# EAGLE schematic Eagle (EAGLE 9.3.0)
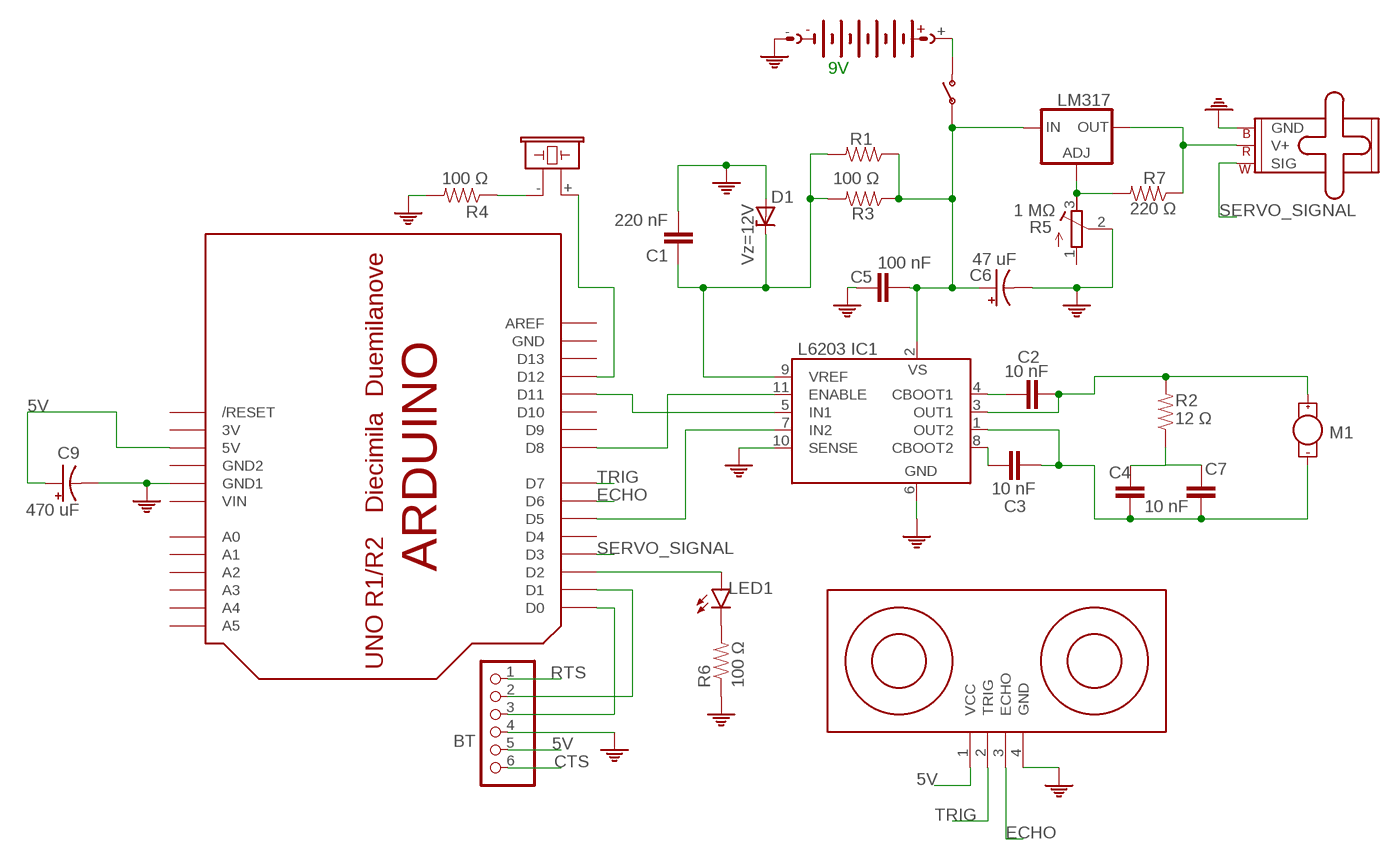
[diagram p0: schematic, sheet 1]

## Parts
9V  9V  AB9V  [AB9V]
BT  PINHD-1X6  [1X06]
C1  220 nF  CAPEZ  [CAP-PTH-SMALLEZ]
C2  10 nF  CAPEZ  [CAP-PTH-SMALLEZ]
C3  10 nF  CAPEZ  [CAP-PTH-SMALLEZ]
C4  10 nF  CAPEZ  [CAP-PTH-SMALLEZ]
C5  100 nF  CAPEZ  [CAP-PTH-SMALLEZ]
C6  47 uF  CPOL-USE5-4  [E5-4]
C7  10 nF  CAPEZ  [CAP-PTH-SMALLEZ]
C9  470 uF  CPOL-USB45181A  [B45181A]
D1  Vz=12V  ZENER-DIODEC1702-15  [C1702-15]
IC1  L6203  [MULTIWATT-11]
LED1  LED1  LED-3MM-NO_SILK  [LED3MM-NS]
LM317  LM317TS  [317TS]
M1  MOTOR10MM  [VIBE-MOTOR-10MM]
M2  SMALL_SERVO  [1X03]
R1  100 Ω  RESISTOREZ  [AXIAL-0.3EZ]
R2  12 Ω  RESISTOREZ  [AXIAL-0.3EZ]
R3  100 Ω  RESISTOREZ  [AXIAL-0.3EZ]
R4  100 Ω  RESISTOREZ  [AXIAL-0.3EZ]
R5  1 MΩ  R-TRIMM3296W  [RTRIM3296W]
R6  100 Ω  RESISTOREZ  [AXIAL-0.3EZ]
R7  220 Ω  RESISTOREZ  [AXIAL-0.3EZ]
SG1  F/CM04P  [F/CM04P]
U$1  ARDUINOUNO  [ARDUINO]
U$2  ULTRASONIC-HC-SR04#V  [ULTRASONIC-HC-SR04#V]
U$3  SWITCH-SPST-2TV  [SWITCH-SPST-VERTICAL]

## Nets
5V: BT.5 C9.+ U$1.5V U$2.1(VCC)
CTS: BT.6
ECHO: U$1.D6 U$2.3(ECHO)
N$1: C4.1 C7.1 R2.P$1
N$2: IC1.7(IN2) U$1.D5
N$3: IC1.5(IN1) U$1.D11
N$4: C3.1 C4.2 C7.2 IC1.1(OUT2) M1.-
N$5: C2.2 IC1.3(OUT1) M1.+ R2.P$2
N$6: IC1.11(ENABLE) U$1.D8
N$7: C2.1 IC1.4(CBOOT1)
N$8: C3.2 IC1.8(CBOOT2)
N$9: C5.2 C6.+ IC1.2(VS) LM317.3(IN) R1.P$1 R3.P$1 U$3.2(P)
N$10: 9V.+ U$3.1(O)
N$11: LED1.A U$1.D2
N$12: SG1.+ U$1.D12
N$13: R4.P$1 SG1.-
N$14: LED1.K(C) R6.P$2
N$15: LM317.1(ADJ) R5.3(E) R7.P$2
N$16: LM317.2(OUT) M2.2(V+) R7.P$1
N$17: M2.1(SIG)
N$18: BT.3 U$1.D0
N$19: BT.2 U$1.D1
PE: 9V.- BT.4 C1.2 C5.1 C6.- C9.- D1.A IC1.6(GND) IC1.10(SENSE) M2.3(GND) R4.P$2 R5.2(S) R6.P$1 U$1.GND1 U$2.4(GND)
RTS: BT.1
SERVO_SIGNAL: U$1.D3
TRIG: U$1.D7 U$2.2(TRIG)
VREF: C1.1 D1.C IC1.9(VREF) R1.P$2 R3.P$2
Unconnected: R5.1(A) U$1.A0 U$1.A1 U$1.A2 U$1.A3 U$1.A4 U$1.A5 U$1.AREF U$1.D4 U$1.D9 U$1.D10 U$1.D13 U$1.RESET(/RESET)

## Notes on the sheet
- 9V

## Power pins joined to a net without a drawn wire
3V: U$1.3V
GND: U$1.GND
GND2: U$1.GND2
VIN: U$1.VIN

## Library data of the parts
9V = battery:AB9V: 9-V BATTERY CLIP
BT = adafruit:PINHD-1X6: PIN HEADER
C1-C5 C7 = SparkFun-Capacitors:CAP: Capacitor Standard 0603 ceramic capacitor, and 0.1" leaded capacitor.
C6 = rcl:CPOL-US: POLARIZED CAPACITOR, American symbol
C9 = resistor:CPOL-US: POLARIZED CAPACITOR, American symbol
D1 = diode:ZENER-DIODE: Z-Diode
IC1 = st-microelectronics:L6203: DMOS FULL BRIDGE DRIVER; MPN: L6203; OC_FARNELL: 1467715; OC_NEWARK: 56P8434
LED1 = SparkFun-LED:LED: LEDs Standard schematic elements and footprints for 5mm, 3mm, 1206, and 0603 sized LEDs. 5mm - Spark Fun Electronics SKU : COM-00529 (and others)
LM317 = v-reg:LM317TS: VOLTAGE REGULATOR
M1 = SparkFun-Electromechanical:MOTOR: Vibration Motor- ROB-08449 Physical dimension and wire connections for this powerful vibration motor. Motor has a self adhesive backing.
M2 = SparkFun-Electromechanical:SMALL_SERVO: Small servo motor This is the small servo used in the SIK. SKU: ROB-09065
R1-R4 R6 R7 = SparkFun-Passives:RESISTOR: Resistor Basic schematic elements and footprints for 0603, 1206, and PTH resistors.
R5 = resistor:R-TRIMM: Trimm resistor
SG1 = buzzer:F/CM04P: BUZZER Source: Buerklin; OC_FARNELL: unknown; OC_NEWARK: unknown
U$1 = adafruit:ARDUINO: Arduino Diecimila/Duemilanove Make a shield with ease, this package has all the named pins as well as the two mounting drill holes and an outline of the USB and DC power connector. The outline is on the DIMENSION layer, so if your board house uses it they will cut the outline to match. http://www.ladyada.net/library/pcb/eaglelibrary.html
U$2 = DIY:ULTRASONIC-HC-SR04: Ultrasonic Ranging Module HC-SR04
U$3 = SparkFun-Electromechanical:SWITCH-SPST-2